# Altium schematic sheet PULSE_SELECT.SchDoc
size A
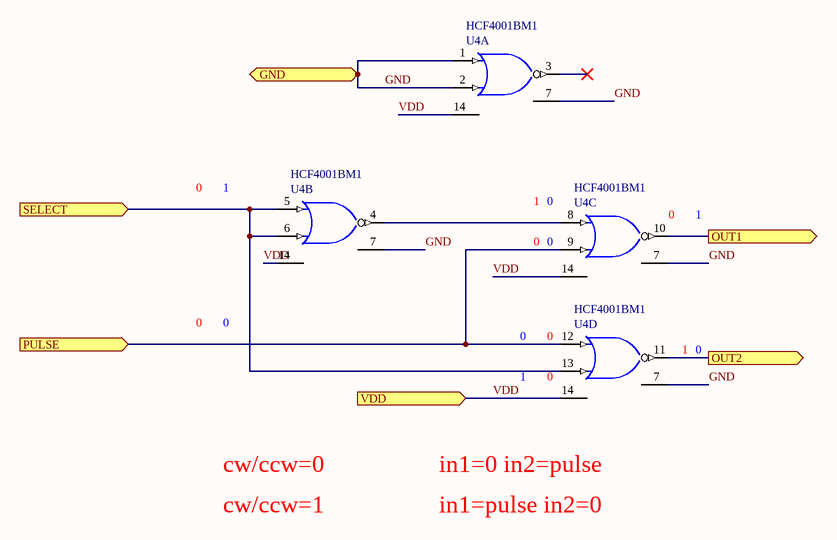
[diagram p0: PULSE_SELECT.SchDoc]

## Parts
U4  HCF4001BM1  [SO14_N]  (parts A,B,C,D of 4)

## Ports
GND (in), OUT1 (out), OUT2 (out), PULSE (in), SELECT (in), VDD (in)

## Nets
GND: U4.1(A) U4.2(B) U4.7(GND) ; port GND
OUT1: U4.10(L) ; port OUT1
OUT2: U4.11(M) ; port OUT2
PULSE: U4.9(F) U4.12(G) ; port PULSE
SELECT: U4.5(C) U4.6(D) U4.13(H) ; port SELECT
VDD: U4.14(VDD) ; port VDD
NetU4_4: U4.4(K) U4.8(E)

Not connected (* = marked no-connect by the designer): U4 3(J)*

## Notes on the sheet
- 0
- 1
- (near U4) 1
- (near U4) 0
- cw/ccw=0
- in1=0 in2=pulse
- cw/ccw=1
- in1=pulse in2=0

## Library data of the parts
U4 = HCF4001BM1: Quad 2-Input NOR Gate; Published: 8-Jun-2000; LatestRevisionDate: 13-Apr-2006; LatestRevisionNote: IPC-7351 Footprint Added.; DatasheetVersion: Sep-1988; PackageVersion: Sep-1998; PackageReference: SO14; Publisher: Altium Limited; PackageDescription: 14-Pin Small Outline Integrated Circuit 1.27 mm Pitch; Code_IPC: SOIC127P600-14; ComponentLink1Description: Manufacturer Link; ComponentLink1URL: http://www.st.com/; ComponentLink2Description: Datasheet; ComponentLink2URL: http://www.st.com/stonline/products/literature/ds/8098/hcf4001.pdf